# Altium schematic sheet power_amp_module.SchDoc
size A
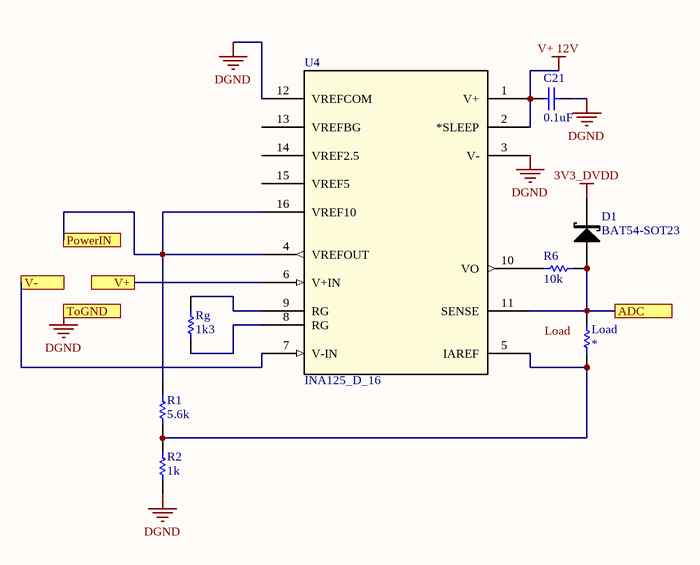
[diagram p0: power_amp_module.SchDoc]

## Parts
C21  0.1uF  [C0805]
D1  BAT54-SOT23  [SOT23-DIODE]
Load  *  [R0603]
R1  5.6k  [R0805]
R2  1k  [R0805]
R6  10k  [R0805]
Rg  1k3  [R0603]
U4  INA125_D_16  [D16]

## Ports
ADC, PowerIN, ToGND, V+, V-

## Nets
3V3_DVDD: D1.K
DGND: C21.2 R2.1 U4.3(V-) U4.12(VREFCOM) ; port ToGND
V+ 12V: C21.1 U4.1(V+) U4.2(*SLEEP)
ADC: D1.A Load.2 R6.1 U4.11(SENSE) ; port ADC
PowerIN: R1.2 U4.4(VREFOUT) U4.16(VREF10) ; port PowerIN
V+: U4.6(V+IN) ; port V+
V-: U4.7(V-IN) ; port V-
NetLoad_1: Load.1 R1.1 R2.2 U4.5(IAREF)
NetR6_2: R6.2 U4.10(VO)
NetRg_1: Rg.1 U4.8(RG)
NetRg_2: Rg.2 U4.9(RG)

Not connected (* = marked no-connect by the designer): U4 13(VREFBG) 14(VREF2.5) 15(VREF5)

## Notes on the sheet
- Labels drawn without touching a wire or pin: Load

## Library data of the parts
C21 = C0805: 0805 Capacitor; Value: 0.1uF
D1 = BAT54-SOT23: SINGLE SHOTTKY DIODE; Manufacturer: NXP Semiconductors; Manufacturer Part Number: BAT54,215; Capacitance @ Vr, F: 10pF @ 1V, 1MHz; Diode Type: Schottky; Current - Average Rectified (Io): 200mA (DC); Voltage - DC Reverse (Vr) (Max): 30V; Reverse Recovery Time (trr): 5ns; Current - Reverse Leakage @ Vr: 2µA @ 25V; Speed: Small Signal =< 200mA (Io), Any Speed; Voltage - Forward (Vf) (Max) @ If: 800mV @ 100mA; Supplier 1: Digi-Key; Supplier Part Number 1: 568-1610-1-ND; Mounting Type: Surface Mount; Package / Case: SOT-23-3, TO-236-3, Micro3™, SSD3, SST3; Packaging: Cut Tape (CT); Category: Discrete Semiconductor Products; RoHS: RoHS Compliant; Supplier Part Number: 568-1610-1-ND; Supplier: Digi-Key
Load Rg = R0603: RESISTOR 0603
  Load: Value: *
  Rg: Value: 1k3
R1 R2 R6 = R0805: RESISTOR 0805
  R1: Value: 5.6k
  R2: Value: 1k
  R6: Value: 10k
U4 = INA125_D_16: Imported; Manufacturer: Texas Instruments; GENERIC_PART_NUMBER: INA125; INDUSTRY_STD_PKG_TYPE: SOIC; FAMILY_NAME: SINGLE SUPPLY; PIN_COUNT: 16; PACKAGE_DESIGNATOR: D; Datasheet_URL: http://www.ti.com/lit/gpn/INA125; Vendor: Texas Instruments; Manufacturer_Part_Number: ina125_d_16; Value: Value; Type: Type; RefDes: RefDes